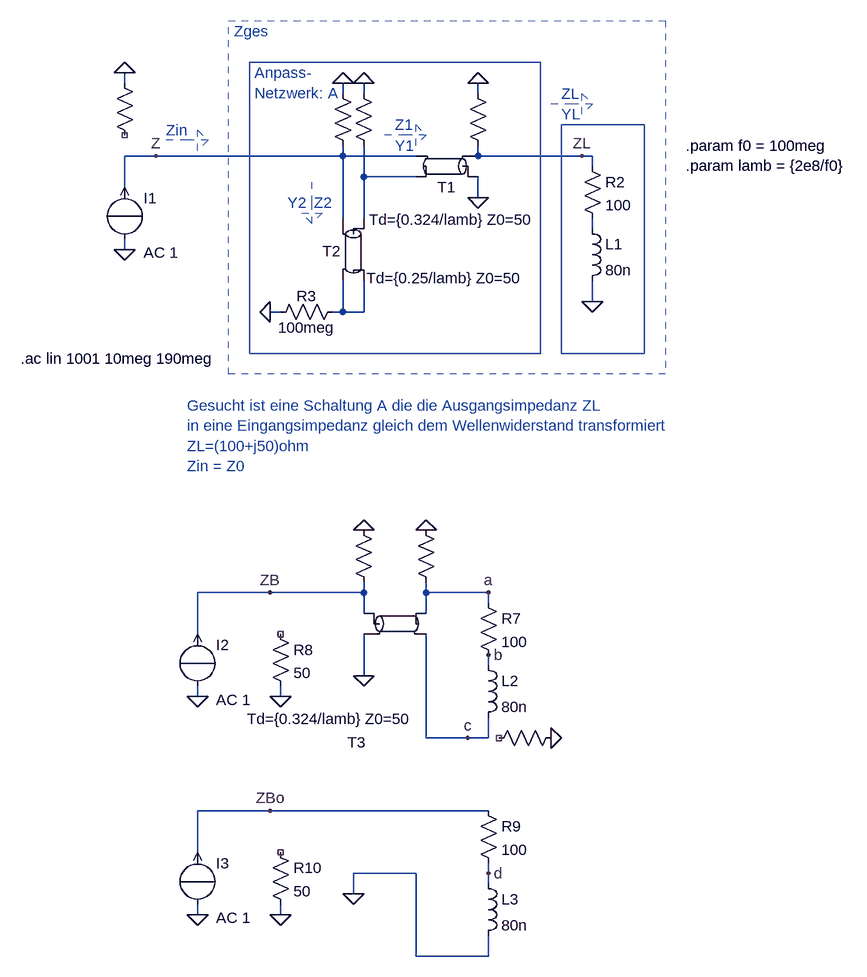
[diagram p0: schematic stichleitung_TUT.asc]
stichleitung_TUT.asc, the LTspice schematic file:
Version 4
SHEET 1 880 948
WIRE -576 -400 -576 -416
WIRE -240 -384 -240 -400
WIRE -208 -384 -208 -400
WIRE -32 -384 -32 -400
WIRE -528 -288 -576 -288
WIRE -240 -288 -240 -304
WIRE -240 -288 -528 -288
WIRE -128 -288 -240 -288
WIRE -32 -288 -32 -304
WIRE 128 -288 -32 -288
WIRE 144 -288 128 -288
WIRE 144 -272 144 -288
WIRE -208 -256 -208 -304
WIRE -128 -256 -208 -256
WIRE -576 -240 -576 -288
WIRE -32 -224 -32 -256
WIRE -240 -192 -240 -288
WIRE -208 -192 -208 -256
WIRE 144 -176 144 -192
WIRE -576 -144 -576 -160
WIRE 144 -64 144 -96
WIRE -336 -48 -352 -48
WIRE -240 -48 -240 -96
WIRE -240 -48 -256 -48
WIRE -208 -48 -208 -96
WIRE -208 -48 -240 -48
WIRE -352 384 -464 384
WIRE -208 384 -208 368
WIRE -208 384 -352 384
WIRE -112 384 -112 368
WIRE -16 384 -112 384
WIRE -16 400 -16 384
WIRE -208 416 -208 384
WIRE -112 416 -112 384
WIRE -464 448 -464 384
WIRE -16 496 -16 480
WIRE -208 512 -208 448
WIRE -464 544 -464 528
WIRE -336 544 -336 528
WIRE -112 608 -112 448
WIRE -48 608 -112 608
WIRE -16 608 -16 576
WIRE -16 608 -48 608
WIRE -352 720 -464 720
WIRE -16 720 -352 720
WIRE -464 784 -464 720
WIRE -128 816 -224 816
WIRE -16 816 -16 800
WIRE -16 832 -16 816
WIRE -224 848 -224 816
WIRE -464 880 -464 864
WIRE -336 880 -336 864
WIRE -128 944 -128 816
WIRE -16 944 -16 912
WIRE -16 944 -128 944
FLAG -576 -144 0
FLAG -32 -400 0
FLAG -528 -288 Z
FLAG -32 -224 0
FLAG 144 -64 0
FLAG -352 -48 0
FLAG -576 -416 0
FLAG -208 -400 0
FLAG 128 -288 ZL
FLAG -240 -400 0
FLAG -352 384 ZB
FLAG -208 512 0
FLAG -464 544 0
FLAG -336 544 0
FLAG -352 720 ZBo
FLAG -224 848 0
FLAG -464 880 0
FLAG -336 880 0
FLAG -16 384 a
FLAG -16 480 b
FLAG -48 608 c
FLAG -208 288 0
FLAG -112 288 0
FLAG 80 608 0
FLAG -16 816 d
SYMBOL source-I -576 -240 R0
WINDOW 123 29 101 Left 2
WINDOW 39 0 0 Left 2
SYMATTR Value2 AC 1
SYMATTR InstName I1
SYMATTR Value ""
SYMBOL res -48 -400 R0
WINDOW 0 36 40 Invisible 2
WINDOW 3 36 76 Invisible 2
SYMATTR InstName R1
SYMATTR Value 100meg
SYMBOL tline -80 -272 R180
WINDOW 3 -8 -98 Top 2
SYMATTR InstName T1
SYMATTR Value Td={0.324/lamb} Z0=50
SYMBOL ind 128 -192 R0
SYMATTR InstName L1
SYMATTR Value 80n
SYMBOL tline -224 -144 R90
WINDOW 0 -13 33 VTop 2
WINDOW 3 60 -141 VBottom 2
SYMATTR InstName T2
SYMATTR Value Td={0.25/lamb} Z0=50
SYMBOL res -352 -32 R270
WINDOW 0 25 56 VTop 2
WINDOW 3 7 56 VBottom 2
SYMATTR InstName R3
SYMATTR Value 100meg
SYMBOL res -592 -416 R0
WINDOW 0 36 40 Invisible 2
WINDOW 3 36 76 Invisible 2
SYMATTR InstName R4
SYMATTR Value 100meg
SYMBOL res -224 -400 R0
WINDOW 0 36 40 Invisible 2
WINDOW 3 36 76 Invisible 2
SYMATTR InstName R5
SYMATTR Value 100meg
SYMBOL res 128 -288 R0
SYMATTR InstName R2
SYMATTR Value 100
SYMBOL res -256 -400 R0
WINDOW 0 36 40 Invisible 2
WINDOW 3 36 76 Invisible 2
SYMATTR InstName R6
SYMATTR Value 100meg
SYMBOL tline -160 432 R0
WINDOW 0 -59 167 Top 2
WINDOW 3 -100 162 Bottom 2
SYMATTR InstName T3
SYMATTR Value Td={0.324/lamb} Z0=50
SYMBOL ind -32 480 R0
SYMATTR InstName L2
SYMATTR Value 80n
SYMBOL res -32 384 R0
SYMATTR InstName R7
SYMATTR Value 100
SYMBOL source-I -464 448 R0
WINDOW 123 29 101 Left 2
WINDOW 39 0 0 Left 2
SYMATTR Value2 AC 1
SYMATTR InstName I2
SYMATTR Value ""
SYMBOL res -352 432 R0
SYMATTR InstName R8
SYMATTR Value 50
SYMBOL ind -32 816 R0
SYMATTR InstName L3
SYMATTR Value 80n
SYMBOL res -32 704 R0
SYMATTR InstName R9
SYMATTR Value 100
SYMBOL source-I -464 784 R0
WINDOW 123 29 101 Left 2
WINDOW 39 0 0 Left 2
SYMATTR Value2 AC 1
SYMATTR InstName I3
SYMATTR Value ""
SYMBOL res -352 768 R0
SYMATTR InstName R10
SYMATTR Value 50
SYMBOL res -224 272 R0
WINDOW 0 36 40 Invisible 2
WINDOW 3 36 76 Invisible 2
SYMATTR InstName R11
SYMATTR Value 100t
SYMBOL res -128 272 R0
WINDOW 0 36 40 Invisible 2
WINDOW 3 36 76 Invisible 2
SYMATTR InstName R12
SYMATTR Value 100t
SYMBOL res 96 592 R90
WINDOW 0 7 56 Invisible 2
WINDOW 3 25 56 Invisible 2
SYMATTR InstName R13
SYMATTR Value 100t
TEXT 288 -304 Left 2 !.param f0 = 100meg\n.param lamb = {2e8/f0}
TEXT -160 -336 Left 2 ;Z1
TEXT -256 -216 Right 2 ;Z2
TEXT -296 -216 Right 2 ;Y2
TEXT -160 -304 Left 2 ;Y1
TEXT -512 -328 Left 2 ;Zin
TEXT -480 96 Left 2 ;Gesucht ist eine Schaltung A die die Ausgangsimpedanz ZL \nin eine Eingangsimpedanz gleich dem Wellenwiderstand transformiert\nZL=(100+j50)ohm\nZin = Z0
TEXT 96 -384 Left 2 ;ZL
TEXT 96 -352 Left 2 ;YL
TEXT -376 -416 Left 2 ;Anpass- \nNetzwerk: A
TEXT -408 -480 Left 2 ;Zges
TEXT -736 24 Left 2 !.ac lin 1001 10meg 190meg
LINE Normal -144 -320 -176 -320 2
LINE Normal -112 -320 -144 -320 2
LINE Normal -128 -336 -112 -320 2
LINE Normal -128 -304 -128 -336 2
LINE Normal -112 -320 -128 -304 2
LINE Normal -288 -216 -288 -248 2
LINE Normal -288 -184 -288 -216 2
LINE Normal -272 -200 -288 -184 2
LINE Normal -304 -200 -272 -200 2
LINE Normal -288 -184 -304 -200 2
LINE Normal -480 -312 -512 -312 2
LINE Normal -448 -312 -480 -312 2
LINE Normal -464 -328 -448 -312 2
LINE Normal -464 -296 -464 -328 2
LINE Normal -448 -312 -464 -296 2
LINE Normal 112 -368 80 -368 2
LINE Normal 144 -368 112 -368 2
LINE Normal 128 -384 144 -368 2
LINE Normal 128 -352 128 -384 2
LINE Normal 144 -368 128 -352 2
RECTANGLE Normal 224 16 96 -336
RECTANGLE Normal 64 16 -384 -432
RECTANGLE Normal 256 48 -416 -496 1

The netlist it stands for:
* stichleitung_TUT.asc
I1 0 Z AC 1
R1 0 ZL 100meg
T1 0 ZL N001 Z Td={0.324/lamb} Z0=50
L1 N002 0 80n
T2 N001 Z N003 N003 Td={0.25/lamb} Z0=50
R3 0 N003 100meg
R4 0 NC_01 100meg
R5 0 N001 100meg
R2 ZL N002 100
R6 0 Z 100meg
T3 ZB 0 a c Td={0.324/lamb} Z0=50
L2 b c 80n
R7 a b 100
I2 0 ZB AC 1
R8 NC_02 0 50
L3 d 0 80n
R9 ZBo d 100
I3 0 ZBo AC 1
R10 NC_03 0 50
R11 0 ZB 100t
R12 0 a 100t
R13 0 NC_04 100t
.param f0 = 100meg
.param lamb = {2e8/f0}
* Z1
* Z2
* Y2
* Y1
* Zin
* Gesucht ist eine Schaltung A die die Ausgangsimpedanz ZL
* in eine Eingangsimpedanz gleich dem Wellenwiderstand transformiert
* ZL=(100+j50)ohm
* Zin = Z0
* ZL
* YL
* Anpass-
* Netzwerk: A
* Zges
.ac lin 1001 10meg 190meg
.backanno
.end